# Altium schematic sheet Extender_FPGA.SchDoc: RFSOC_AMC
size 420 x 297 mm; Author: G.Kasprowicz; CompanyName: WUT ISE; DrawnBy: G.Kasprowicz; Organization: WUT ISE; Address1: PW ISE; Address2: Nowowiejska 15/19 00-665 Warsaw; Address3: gkasprow@gmail.com; DocumentNumber: 11; Revision: 2; SheetNumber: 12; SheetTotal: 54; ModifiedBy: -; CheckedDate: -; Title2: 8 channel ADC & DAC; DivGrp: WUT ISE; Designer: G.Kasprowicz; ModifiedDate: -; ProjectName: Sensor Box
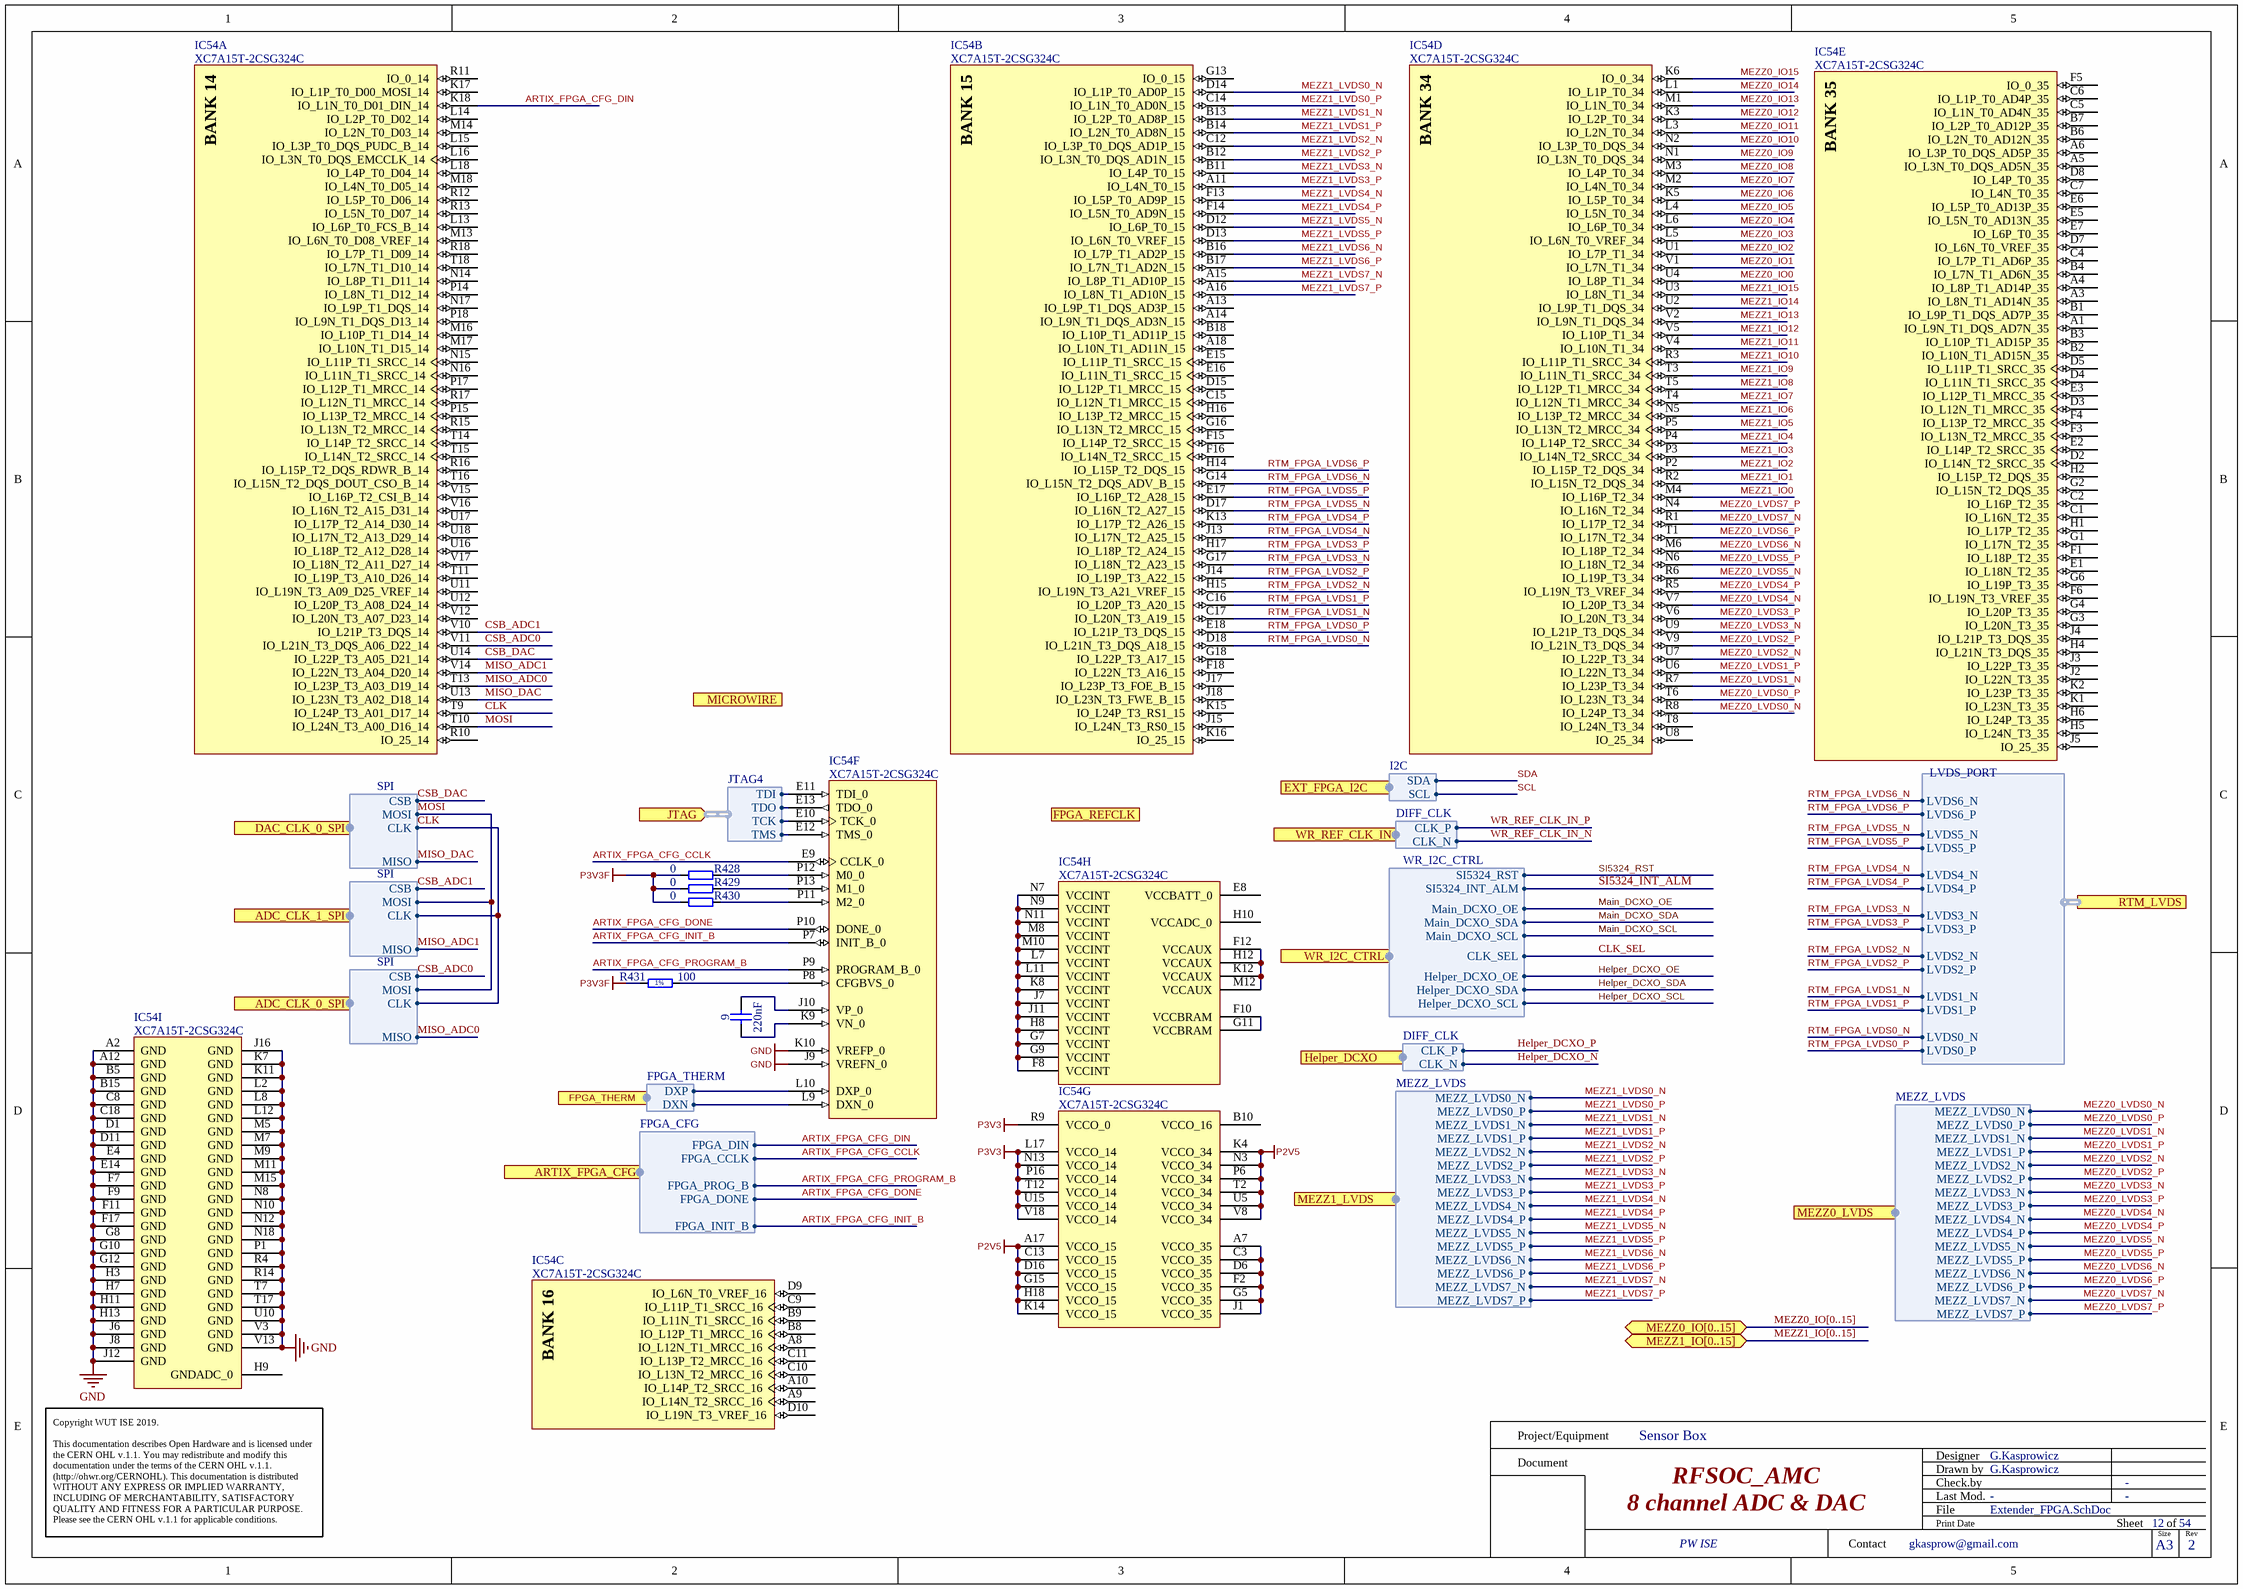
[diagram p0: Extender_FPGA.SchDoc]

## Parts
9  220nF  [CAPC0603X33N]
IC54  XC7A15T-2CSG324C  [BGA324C80P18X18_1500X1500X150]  (parts A,B,C,D,E,F,G,H,I of 9)
R428  0  [RESC1005X40N]
R429  0  [RESC1005X40N]
R430  0  [RESC1005X40N]
R431  100  [RESC1005X40N]

## Ports
ADC_CLK_0_SPI (harness SPI), ADC_CLK_1_SPI (harness SPI), ARTIX_FPGA_CFG (harness FPGA_CFG), DAC_CLK_0_SPI (harness SPI), EXT_FPGA_I2C (harness I2C), FPGA_REFCLK (harness CLK), FPGA_THERM (harness FPGA_THERM), Helper_DCXO (harness DIFF_CLK), JTAG (in, harness JTAG4), MEZZ0_IO[0..15] (bidir), MEZZ0_LVDS (harness MEZZ_LVDS), MEZZ1_IO[0..15] (bidir), MEZZ1_LVDS (harness MEZZ_LVDS), MICROWIRE, RTM_LVDS (harness LVDS_PORT), WR_I2C_CTRL (harness WR_I2C_CTRL), WR_REF_CLK_IN (harness DIFF_CLK)

## Harnesses
LVDS_PORT: LVDS0_P, LVDS0_N, LVDS1_P, LVDS1_N, LVDS2_P, LVDS2_N, LVDS3_P, LVDS3_N, LVDS4_P, LVDS4_N, LVDS5_P, LVDS5_N, LVDS6_P, LVDS6_N
MEZZ_LVDS: MEZZ_LVDS0_N, MEZZ_LVDS0_P, MEZZ_LVDS1_N, MEZZ_LVDS1_P, MEZZ_LVDS2_N, MEZZ_LVDS2_P, MEZZ_LVDS3_N, MEZZ_LVDS3_P, MEZZ_LVDS4_N, MEZZ_LVDS4_P, MEZZ_LVDS5_N, MEZZ_LVDS5_P, MEZZ_LVDS6_N, MEZZ_LVDS6_P, MEZZ_LVDS7_N, MEZZ_LVDS7_P
DIFF_CLK: CLK_N, CLK_P
WR_I2C_CTRL: Main_DCXO_OE, Main_DCXO_SDA, Main_DCXO_SCL, Helper_DCXO_OE, Helper_DCXO_SDA, Helper_DCXO_SCL, CLK_SEL, SI5324_RST, SI5324_INT_ALM
I2C: SCL, SDA
JTAG4: TCK, TDI, TDO, TMS
FPGA_CFG: FPGA_DIN, FPGA_CCLK, FPGA_PROG_B, FPGA_DONE, FPGA_INIT_B
FPGA_THERM: DXP, DXN
SPI: MOSI, MISO, CSB, CLK

## Nets
GND: IC54.A2(GND) IC54.A12(GND) IC54.B5(GND) IC54.B15(GND) IC54.C8(GND) IC54.C18(GND) IC54.D1(GND) IC54.D11(GND) IC54.E4(GND) IC54.E14(GND) IC54.F7(GND) IC54.F9(GND) IC54.F11(GND) IC54.F17(GND) IC54.G8(GND) IC54.G10(GND) IC54.G12(GND) IC54.H3(GND) IC54.H7(GND) IC54.H11(GND) IC54.H13(GND) IC54.J6(GND) IC54.J8(GND) IC54.J9(VREFN_0) IC54.J12(GND) IC54.J16(GND) IC54.K7(GND) IC54.K10(VREFP_0) IC54.K11(GND) IC54.L2(GND) IC54.L8(GND) IC54.L12(GND) IC54.M5(GND) IC54.M7(GND) IC54.M9(GND) IC54.M11(GND) IC54.M15(GND) IC54.N8(GND) IC54.N10(GND) IC54.N12(GND) IC54.N18(GND) IC54.P1(GND) IC54.R4(GND) IC54.R14(GND) IC54.T7(GND) IC54.T17(GND) IC54.U10(GND) IC54.V3(GND) IC54.V13(GND)
P2V5: IC54.A17(VCCO_15) IC54.C13(VCCO_15) IC54.D16(VCCO_15) IC54.G15(VCCO_15) IC54.H18(VCCO_15) IC54.K4(VCCO_34) IC54.K14(VCCO_15) IC54.N3(VCCO_34) IC54.P6(VCCO_34) IC54.T2(VCCO_34) IC54.U5(VCCO_34) IC54.V8(VCCO_34)
P3V3: IC54.L17(VCCO_14) IC54.N13(VCCO_14) IC54.P16(VCCO_14) IC54.R9(VCCO_0) IC54.T12(VCCO_14) IC54.U15(VCCO_14) IC54.V18(VCCO_14)
P3V3F: R428.1 R429.1 R430.1 R431.1
ARTIX_FPGA_CFG_CCLK: IC54.E9(CCLK_0) ; port ARTIX_FPGA_CFG.FPGA_CCLK
ARTIX_FPGA_CFG_DIN: IC54.K18(IO_L1N_T0_D01_DIN_14) ; port ARTIX_FPGA_CFG.FPGA_DIN
ARTIX_FPGA_CFG_DONE: IC54.P10(DONE_0) ; port ARTIX_FPGA_CFG.FPGA_DONE
ARTIX_FPGA_CFG_INIT_B: IC54.P7(INIT_B_0) ; port ARTIX_FPGA_CFG.FPGA_INIT_B
ARTIX_FPGA_CFG_PROGRAM_B: IC54.P9(PROGRAM_B_0) ; port ARTIX_FPGA_CFG.FPGA_PROG_B
CLK: IC54.T9(IO_L24P_T3_A01_D17_14) ; port DAC_CLK_0_SPI.CLK, port ADC_CLK_1_SPI.CLK, port ADC_CLK_0_SPI.CLK
CLK_SEL: port WR_I2C_CTRL.CLK_SEL
CSB_ADC0: IC54.V11(IO_L21N_T3_DQS_A06_D22_14) ; port ADC_CLK_0_SPI.CSB
CSB_ADC1: IC54.V10(IO_L21P_T3_DQS_14) ; port ADC_CLK_1_SPI.CSB
CSB_DAC: IC54.U14(IO_L22P_T3_A05_D21_14) ; port DAC_CLK_0_SPI.CSB
Helper_DCXO_N: port Helper_DCXO.CLK_N
Helper_DCXO_OE: port WR_I2C_CTRL.Helper_DCXO_OE
Helper_DCXO_P: port Helper_DCXO.CLK_P
Helper_DCXO_SCL: port WR_I2C_CTRL.Helper_DCXO_SCL
Helper_DCXO_SDA: port WR_I2C_CTRL.Helper_DCXO_SDA
Main_DCXO_OE: port WR_I2C_CTRL.Main_DCXO_OE
Main_DCXO_SCL: port WR_I2C_CTRL.Main_DCXO_SCL
Main_DCXO_SDA: port WR_I2C_CTRL.Main_DCXO_SDA
MEZZ0_IO0: IC54.U4(IO_L8P_T1_34)
MEZZ0_IO1: IC54.V1(IO_L7N_T1_34)
MEZZ0_IO2: IC54.U1(IO_L7P_T1_34)
MEZZ0_IO3: IC54.L5(IO_L6N_T0_VREF_34)
MEZZ0_IO4: IC54.L6(IO_L6P_T0_34)
MEZZ0_IO5: IC54.L4(IO_L5N_T0_34)
MEZZ0_IO6: IC54.K5(IO_L5P_T0_34)
MEZZ0_IO7: IC54.M2(IO_L4N_T0_34)
MEZZ0_IO8: IC54.M3(IO_L4P_T0_34)
MEZZ0_IO9: IC54.N1(IO_L3N_T0_DQS_34)
MEZZ0_IO10: IC54.N2(IO_L3P_T0_DQS_34)
MEZZ0_IO11: IC54.L3(IO_L2N_T0_34)
MEZZ0_IO12: IC54.K3(IO_L2P_T0_34)
MEZZ0_IO13: IC54.M1(IO_L1N_T0_34)
MEZZ0_IO14: IC54.L1(IO_L1P_T0_34)
MEZZ0_IO15: IC54.K6(IO_0_34)
MEZZ0_LVDS0_N: IC54.R8(IO_L24P_T3_34) ; port MEZZ0_LVDS.MEZZ_LVDS0_N
MEZZ0_LVDS0_P: IC54.T6(IO_L23N_T3_34) ; port MEZZ0_LVDS.MEZZ_LVDS0_P
MEZZ0_LVDS1_N: IC54.R7(IO_L23P_T3_34) ; port MEZZ0_LVDS.MEZZ_LVDS1_N
MEZZ0_LVDS1_P: IC54.U6(IO_L22N_T3_34) ; port MEZZ0_LVDS.MEZZ_LVDS1_P
MEZZ0_LVDS2_N: IC54.U7(IO_L22P_T3_34) ; port MEZZ0_LVDS.MEZZ_LVDS2_N
MEZZ0_LVDS2_P: IC54.V9(IO_L21N_T3_DQS_34) ; port MEZZ0_LVDS.MEZZ_LVDS2_P
MEZZ0_LVDS3_N: IC54.U9(IO_L21P_T3_DQS_34) ; port MEZZ0_LVDS.MEZZ_LVDS3_N
MEZZ0_LVDS3_P: IC54.V6(IO_L20N_T3_34) ; port MEZZ0_LVDS.MEZZ_LVDS3_P
MEZZ0_LVDS4_N: IC54.V7(IO_L20P_T3_34) ; port MEZZ0_LVDS.MEZZ_LVDS4_N
MEZZ0_LVDS4_P: IC54.R5(IO_L19N_T3_VREF_34) ; port MEZZ0_LVDS.MEZZ_LVDS4_P
MEZZ0_LVDS5_N: IC54.R6(IO_L19P_T3_34) ; port MEZZ0_LVDS.MEZZ_LVDS5_N
MEZZ0_LVDS5_P: IC54.N6(IO_L18N_T2_34) ; port MEZZ0_LVDS.MEZZ_LVDS5_P
MEZZ0_LVDS6_N: IC54.M6(IO_L18P_T2_34) ; port MEZZ0_LVDS.MEZZ_LVDS6_N
MEZZ0_LVDS6_P: IC54.T1(IO_L17N_T2_34) ; port MEZZ0_LVDS.MEZZ_LVDS6_P
MEZZ0_LVDS7_N: IC54.R1(IO_L17P_T2_34) ; port MEZZ0_LVDS.MEZZ_LVDS7_N
MEZZ0_LVDS7_P: IC54.N4(IO_L16N_T2_34) ; port MEZZ0_LVDS.MEZZ_LVDS7_P
MEZZ1_IO0: IC54.M4(IO_L16P_T2_34)
MEZZ1_IO1: IC54.R2(IO_L15N_T2_DQS_34)
MEZZ1_IO2: IC54.P2(IO_L15P_T2_DQS_34)
MEZZ1_IO3: IC54.P3(IO_L14N_T2_SRCC_34)
MEZZ1_IO4: IC54.P4(IO_L14P_T2_SRCC_34)
MEZZ1_IO5: IC54.P5(IO_L13N_T2_MRCC_34)
MEZZ1_IO6: IC54.N5(IO_L13P_T2_MRCC_34)
MEZZ1_IO7: IC54.T4(IO_L12N_T1_MRCC_34)
MEZZ1_IO8: IC54.T5(IO_L12P_T1_MRCC_34)
MEZZ1_IO9: IC54.T3(IO_L11N_T1_SRCC_34)
MEZZ1_IO10: IC54.R3(IO_L11P_T1_SRCC_34)
MEZZ1_IO11: IC54.V4(IO_L10N_T1_34)
MEZZ1_IO12: IC54.V5(IO_L10P_T1_34)
MEZZ1_IO13: IC54.V2(IO_L9N_T1_DQS_34)
MEZZ1_IO14: IC54.U2(IO_L9P_T1_DQS_34)
MEZZ1_IO15: IC54.U3(IO_L8N_T1_34)
MEZZ1_LVDS0_N: IC54.D14(IO_L1P_T0_AD0P_15) ; port MEZZ1_LVDS.MEZZ_LVDS0_N
MEZZ1_LVDS0_P: IC54.C14(IO_L1N_T0_AD0N_15) ; port MEZZ1_LVDS.MEZZ_LVDS0_P
MEZZ1_LVDS1_N: IC54.B13(IO_L2P_T0_AD8P_15) ; port MEZZ1_LVDS.MEZZ_LVDS1_N
MEZZ1_LVDS1_P: IC54.B14(IO_L2N_T0_AD8N_15) ; port MEZZ1_LVDS.MEZZ_LVDS1_P
MEZZ1_LVDS2_N: IC54.C12(IO_L3P_T0_DQS_AD1P_15) ; port MEZZ1_LVDS.MEZZ_LVDS2_N
MEZZ1_LVDS2_P: IC54.B12(IO_L3N_T0_DQS_AD1N_15) ; port MEZZ1_LVDS.MEZZ_LVDS2_P
MEZZ1_LVDS3_N: IC54.B11(IO_L4P_T0_15) ; port MEZZ1_LVDS.MEZZ_LVDS3_N
MEZZ1_LVDS3_P: IC54.A11(IO_L4N_T0_15) ; port MEZZ1_LVDS.MEZZ_LVDS3_P
MEZZ1_LVDS4_N: IC54.F13(IO_L5P_T0_AD9P_15) ; port MEZZ1_LVDS.MEZZ_LVDS4_N
MEZZ1_LVDS4_P: IC54.F14(IO_L5N_T0_AD9N_15) ; port MEZZ1_LVDS.MEZZ_LVDS4_P
MEZZ1_LVDS5_N: IC54.D12(IO_L6P_T0_15) ; port MEZZ1_LVDS.MEZZ_LVDS5_N
MEZZ1_LVDS5_P: IC54.D13(IO_L6N_T0_VREF_15) ; port MEZZ1_LVDS.MEZZ_LVDS5_P
MEZZ1_LVDS6_N: IC54.B16(IO_L7P_T1_AD2P_15) ; port MEZZ1_LVDS.MEZZ_LVDS6_N
MEZZ1_LVDS6_P: IC54.B17(IO_L7N_T1_AD2N_15) ; port MEZZ1_LVDS.MEZZ_LVDS6_P
MEZZ1_LVDS7_N: IC54.A15(IO_L8P_T1_AD10P_15) ; port MEZZ1_LVDS.MEZZ_LVDS7_N
MEZZ1_LVDS7_P: IC54.A16(IO_L8N_T1_AD10N_15) ; port MEZZ1_LVDS.MEZZ_LVDS7_P
MISO_ADC0: IC54.T13(IO_L23P_T3_A03_D19_14) ; port ADC_CLK_0_SPI.MISO
MISO_ADC1: IC54.V14(IO_L22N_T3_A04_D20_14) ; port ADC_CLK_1_SPI.MISO
MISO_DAC: IC54.U13(IO_L23N_T3_A02_D18_14) ; port DAC_CLK_0_SPI.MISO
MOSI: IC54.T10(IO_L24N_T3_A00_D16_14) ; port DAC_CLK_0_SPI.MOSI, port ADC_CLK_1_SPI.MOSI, port ADC_CLK_0_SPI.MOSI
RTM_FPGA_LVDS0_N: IC54.D18(IO_L21N_T3_DQS_A18_15) ; port RTM_LVDS.LVDS0_N
RTM_FPGA_LVDS0_P: IC54.E18(IO_L21P_T3_DQS_15) ; port RTM_LVDS.LVDS0_P
RTM_FPGA_LVDS1_N: IC54.C17(IO_L20N_T3_A19_15) ; port RTM_LVDS.LVDS1_N
RTM_FPGA_LVDS1_P: IC54.C16(IO_L20P_T3_A20_15) ; port RTM_LVDS.LVDS1_P
RTM_FPGA_LVDS2_N: IC54.H15(IO_L19N_T3_A21_VREF_15) ; port RTM_LVDS.LVDS2_N
RTM_FPGA_LVDS2_P: IC54.J14(IO_L19P_T3_A22_15) ; port RTM_LVDS.LVDS2_P
RTM_FPGA_LVDS3_N: IC54.G17(IO_L18N_T2_A23_15) ; port RTM_LVDS.LVDS3_N
RTM_FPGA_LVDS3_P: IC54.H17(IO_L18P_T2_A24_15) ; port RTM_LVDS.LVDS3_P
RTM_FPGA_LVDS4_N: IC54.J13(IO_L17N_T2_A25_15) ; port RTM_LVDS.LVDS4_N
RTM_FPGA_LVDS4_P: IC54.K13(IO_L17P_T2_A26_15) ; port RTM_LVDS.LVDS4_P
RTM_FPGA_LVDS5_N: IC54.D17(IO_L16N_T2_A27_15) ; port RTM_LVDS.LVDS5_N
RTM_FPGA_LVDS5_P: IC54.E17(IO_L16P_T2_A28_15) ; port RTM_LVDS.LVDS5_P
RTM_FPGA_LVDS6_N: IC54.G14(IO_L15N_T2_DQS_ADV_B_15) ; port RTM_LVDS.LVDS6_N
RTM_FPGA_LVDS6_P: IC54.H14(IO_L15P_T2_DQS_15) ; port RTM_LVDS.LVDS6_P
SCL: port EXT_FPGA_I2C.SCL
SDA: port EXT_FPGA_I2C.SDA
SI5324_INT_ALM: port WR_I2C_CTRL.SI5324_INT_ALM
SI5324_RST: port WR_I2C_CTRL.SI5324_RST
WR_REF_CLK_IN_N: port WR_REF_CLK_IN.CLK_N
WR_REF_CLK_IN_P: port WR_REF_CLK_IN.CLK_P
Net9_1: 9.1 IC54.K9(VN_0)
Net9_2: 9.2 IC54.J10(VP_0)
NetIC54_A7: IC54.A7(VCCO_35) IC54.C3(VCCO_35) IC54.D6(VCCO_35) IC54.F2(VCCO_35) IC54.G5(VCCO_35) IC54.J1(VCCO_35)
NetIC54_E10: IC54.E10(TCK_0) ; port JTAG.TCK
NetIC54_E11: IC54.E11(TDI_0) ; port JTAG.TDI
NetIC54_E12: IC54.E12(TMS_0) ; port JTAG.TMS
NetIC54_E13: IC54.E13(TDO_0) ; port JTAG.TDO
NetIC54_F8: IC54.F8(VCCINT) IC54.G7(VCCINT) IC54.G9(VCCINT) IC54.H8(VCCINT) IC54.J7(VCCINT) IC54.J11(VCCINT) IC54.K8(VCCINT) IC54.L7(VCCINT) IC54.L11(VCCINT) IC54.M8(VCCINT) IC54.M10(VCCINT) IC54.N7(VCCINT) IC54.N9(VCCINT) IC54.N11(VCCINT)
NetIC54_F10: IC54.F10(VCCBRAM) IC54.G11(VCCBRAM)
NetIC54_F12: IC54.F12(VCCAUX) IC54.H12(VCCAUX) IC54.K12(VCCAUX) IC54.M12(VCCAUX)
NetIC54_L9: IC54.L9(DXN_0) ; port FPGA_THERM.DXN
NetIC54_L10: IC54.L10(DXP_0) ; port FPGA_THERM.DXP
NetIC54_P8: IC54.P8(CFGBVS_0) R431.2
NetIC54_P11: IC54.P11(M2_0) R430.2
NetIC54_P12: IC54.P12(M0_0) R428.2
NetIC54_P13: IC54.P13(M1_0) R429.2

Not connected (* = marked no-connect by the designer): IC54 A1(IO_L9N_T1_DQS_AD7N_35) A3(IO_L8N_T1_AD14N_35) A4(IO_L8P_T1_AD14P_35) A5(IO_L3N_T0_DQS_AD5N_35) A6(IO_L3P_T0_DQS_AD5P_35) A8(IO_L12N_T1_MRCC_16) A9(IO_L14N_T2_SRCC_16) A10(IO_L14P_T2_SRCC_16) A13(IO_L9P_T1_DQS_AD3P_15) A14(IO_L9N_T1_DQS_AD3N_15) A18(IO_L10N_T1_AD11N_15) B1(IO_L9P_T1_DQS_AD7P_35) B2(IO_L10N_T1_AD15N_35) B3(IO_L10P_T1_AD15P_35) B4(IO_L7N_T1_AD6N_35) B6(IO_L2N_T0_AD12N_35) B7(IO_L2P_T0_AD12P_35) B8(IO_L12P_T1_MRCC_16) B9(IO_L11N_T1_SRCC_16) B10(VCCO_16) B18(IO_L10P_T1_AD11P_15) C1(IO_L16N_T2_35) C2(IO_L16P_T2_35) C4(IO_L7P_T1_AD6P_35) C5(IO_L1N_T0_AD4N_35) C6(IO_L1P_T0_AD4P_35) C7(IO_L4N_T0_35) C9(IO_L11P_T1_SRCC_16) C10(IO_L13N_T2_MRCC_16) C11(IO_L13P_T2_MRCC_16) C15(IO_L12N_T1_MRCC_15) D2(IO_L14N_T2_SRCC_35) D3(IO_L12N_T1_MRCC_35) D4(IO_L11N_T1_SRCC_35) D5(IO_L11P_T1_SRCC_35) D7(IO_L6N_T0_VREF_35) D8(IO_L4P_T0_35) D9(IO_L6N_T0_VREF_16) D10(IO_L19N_T3_VREF_16) D15(IO_L12P_T1_MRCC_15) E1(IO_L18N_T2_35) E2(IO_L14P_T2_SRCC_35) E3(IO_L12P_T1_MRCC_35) E5(IO_L5N_T0_AD13N_35) E6(IO_L5P_T0_AD13P_35) E7(IO_L6P_T0_35) E8(VCCBATT_0) E15(IO_L11P_T1_SRCC_15) E16(IO_L11N_T1_SRCC_15) F1(IO_L18P_T2_35) F3(IO_L13N_T2_MRCC_35) F4(IO_L13P_T2_MRCC_35) F5(IO_0_35) F6(IO_L19N_T3_VREF_35) F15(IO_L14P_T2_SRCC_15) F16(IO_L14N_T2_SRCC_15) F18(IO_L22N_T3_A16_15) G1(IO_L17N_T2_35) G2(IO_L15N_T2_DQS_35) G3(IO_L20N_T3_35) G4(IO_L20P_T3_35) G6(IO_L19P_T3_35) G13(IO_0_15) G16(IO_L13N_T2_MRCC_15) G18(IO_L22P_T3_A17_15) H1(IO_L17P_T2_35) H2(IO_L15P_T2_DQS_35) H4(IO_L21N_T3_DQS_35) H5(IO_L24N_T3_35) H6(IO_L24P_T3_35) H9(GNDADC_0) H10(VCCADC_0) H16(IO_L13P_T2_MRCC_15) J2(IO_L22N_T3_35) J3(IO_L22P_T3_35) J4(IO_L21P_T3_DQS_35) J5(IO_25_35) J15(IO_L24N_T3_RS0_15) J17(IO_L23P_T3_FOE_B_15) J18(IO_L23N_T3_FWE_B_15) K1(IO_L23N_T3_35) K2(IO_L23P_T3_35) K15(IO_L24P_T3_RS1_15) K16(IO_25_15) K17(IO_L1P_T0_D00_MOSI_14) L13(IO_L6P_T0_FCS_B_14) L14(IO_L2P_T0_D02_14) L15(IO_L3P_T0_DQS_PUDC_B_14) L16(IO_L3N_T0_DQS_EMCCLK_14) L18(IO_L4P_T0_D04_14) M13(IO_L6N_T0_D08_VREF_14) M14(IO_L2N_T0_D03_14) M16(IO_L10P_T1_D14_14) M17(IO_L10N_T1_D15_14) M18(IO_L4N_T0_D05_14) N14(IO_L8P_T1_D11_14) N15(IO_L11P_T1_SRCC_14) N16(IO_L11N_T1_SRCC_14) N17(IO_L9P_T1_DQS_14) P14(IO_L8N_T1_D12_14) P15(IO_L13P_T2_MRCC_14) P17(IO_L12P_T1_MRCC_14) P18(IO_L9N_T1_DQS_D13_14) R10(IO_25_14) R11(IO_0_14) R12(IO_L5P_T0_D06_14) R13(IO_L5N_T0_D07_14) R15(IO_L13N_T2_MRCC_14) R16(IO_L15P_T2_DQS_RDWR_B_14) R17(IO_L12N_T1_MRCC_14) R18(IO_L7P_T1_D09_14) T8(IO_L24N_T3_34) T11(IO_L19P_T3_A10_D26_14) T14(IO_L14P_T2_SRCC_14) T15(IO_L14N_T2_SRCC_14) T16(IO_L15N_T2_DQS_DOUT_CSO_B_14) T18(IO_L7N_T1_D10_14) U8(IO_25_34) U11(IO_L19N_T3_A09_D25_VREF_14) U12(IO_L20P_T3_A08_D24_14) U16(IO_L18P_T2_A12_D28_14) U17(IO_L17P_T2_A14_D30_14) U18(IO_L17N_T2_A13_D29_14) V12(IO_L20N_T3_A07_D23_14) V15(IO_L16P_T2_CSI_B_14) V16(IO_L16N_T2_A15_D31_14) V17(IO_L18N_T2_A11_D27_14)

## Buses and harness runs
bus MEZZ0_IO[0..15] = port MEZZ0_IO[0..15]
bus MEZZ1_IO[0..15] = port MEZZ1_IO[0..15]

## Notes on the sheet
- Project/Equipment
- Document
- Designer
- Drawn by
- Check.by
- Copyright WUT ISE 2019.
  This documentation describes Open Hardware and is licensed under the CERN OHL v.1.1. You may redistribute and modify this documentation under the terms of the CERN OHL v.1.1. (http://ohwr.org/CERNOHL). This documentation is distributed WITHOUT ANY EXPRESS OR IMPLIED WARRANTY, INCLUDING OF MERCHANTABILITY, SATISFACTORY QUALITY AND FITNESS FOR A PARTICULAR PURPOSE. Please see the CERN OHL v.1.1 for applicable conditions.
- Contact
- File
- Last Mod.
- Print Date
- Sheet
- Size
- A3
- of
- Rev
- (in symbol R0402_100R_1%_0.1W_100PPM) 1%
- (in symbol XC7A15T-2CSG324C, part A) BANK 14
- (in symbol XC7A15T-2CSG324C, part B) BANK 15
- (in symbol XC7A15T-2CSG324C, part C) BANK 16
- (in symbol XC7A15T-2CSG324C, part D) BANK 34
- (in symbol XC7A15T-2CSG324C, part E) BANK 35

## Library data of the parts
9 = CC0201_220NF_6.3V_20%_X5R: Non-polarised capacitor; Manufacturer: GENERIC; Manufacturer1 Part Number: JMK063BJ224MP-F; Part Description: SMD Multilayer Chip Ceramic Capacitor; TC: X5R; Tolerance: ±20%; Voltage: 6.3V; Case: 0201; Manufacturer Part Number: CC0201_220NF_6.3V_20%_X5R; Manufacturer1 Example: TAIYO YUDEN; Part Number: CC0201_220NF_6.3V_20%_X5R; Pin Count: 2; SMD: Yes; Status: Not Recommended; Value: 220nF; Component Kind: Standard; Component Type: Standard; Mounted: Yes; Socket: No; Sense: No; Manufacturer1 ComponentHeight: 0.33mm; HelpURL: \\cern.ch\dfs\Applications\Altium\Datasheets\CC0201_X5R_TAIYO-YUDEN_STANDARD-CLASS2.pdf; Author: CERN DEM JLC; CreateDate: 27.05.2010; LatestRevisionDate: 27.05.2010
IC54 = XC7A15T-2CSG324C: Artix-7 FPGA, 210 User I/Os, 0 GTP, 324-Ball BGA, Speed Grade 2, Commercial Grade, Pb-Free; Manufacturer: XILINX; PressFit: No; Bonding: No; Part Number: XC7A15T-2CSG324C; Component Kind: Standard; Component Type: Standard; Device: XC7A15T-2CSG324C; PackageDescription: BGA, 0.80mm Pitch, Square; 324 Pin, 18 Columns X 18 Rows, Body 15.00mm X 15.00mm X 1.50mm H, IPC Medium Density; Part Description: Artix-7 FPGA, 210 User I/Os, 0 GTP, 324-Ball BGA, Speed Grade 2, Commercial Grade, Pb-Free; Manufacturer Part Number: XC7A15T-2CSG324C; Pin Count: 324; Case: BGA324; Mounted: Yes; Socket: No; SMD: Yes; Sense: No; ComponentHeight: 1.5mm; HelpURL: \\cern.ch\dfs\Applications\Altium\Datasheets\XC7A15T-2CSG324C.pdf; ComponentLink1URL: \\cern.ch\dfs\Applications\Altium\Datasheets\XC7A15T-2CSG324C_Package-Pinout.pdf; ComponentLink1Description: Package/Pinout; Author: CERN DEM MR; CreateDate: 14/03/2016; LatestRevisionDate: 14/03/2016
R428-R430 = R0402_0R_JUMPER: Resistor; Manufacturer: GENERIC; Manufacturer1 Part Number: 232270591001L; Part Description: 1A (0.05R Max DC Resistance) Zero Ohm Jumper; PressFit: No; Case: 0402; Manufacturer Part Number: R0402_0R_JUMPER; Manufacturer1 ComponentHeight: 0.4mm; Manufacturer1 Example: YAGEO PHYCOMP; Part Number: R0402_0R_JUMPER; Pin Count: 2; Sense: No; SMD: Yes; Status: Not Recommended; Value: 0; Component Kind: Standard; Component Type: Standard; Mounted: Yes; Socket: No; HelpURL: \\cern.ch\dfs\Applications\Altium\Datasheets\R0402_Phycomp_RC0402.pdf; Author: CERN DEM JLC; CreateDate: 03.12.2007; LatestRevisionDate: 17.10.2012
R431 = R0402_100R_1%_0.1W_100PPM: Resistor - 1%; Manufacturer Part Number: R0402_100R_1%_0.1W_100PPM_50V; Manufacturer: GENERIC; Manufacturer1 Part Number: ERJ2RKF1000X; Part Description: General Purpose Thick Film Chip Resistor; Power: 0.1W; TC: ±100ppm/°C; Voltage: 50V; PressFit: No; Case: 0402; Manufacturer1 ComponentHeight: 0.4mm; Manufacturer1 Example: PANASONIC; Part Number: R0402_100R_1%_0.1W_100PPM; Pin Count: 2; Sense: No; SMD: Yes; Status: Not Recommended; Tolerance: ±1%; Value: 100; Component Kind: Standard; Component Type: Standard; Mounted: Yes; Socket: No; HelpURL: \\cern.ch\dfs\Applications\Altium\Datasheets\R0402_PANASONIC_ERJ2RK.pdf; Author: CERN DEM JLC; CreateDate: 12.12.2013; LatestRevisionDate: 03.03.2015